# EAGLE design v1_r0 (EAGLE 9.6.2)
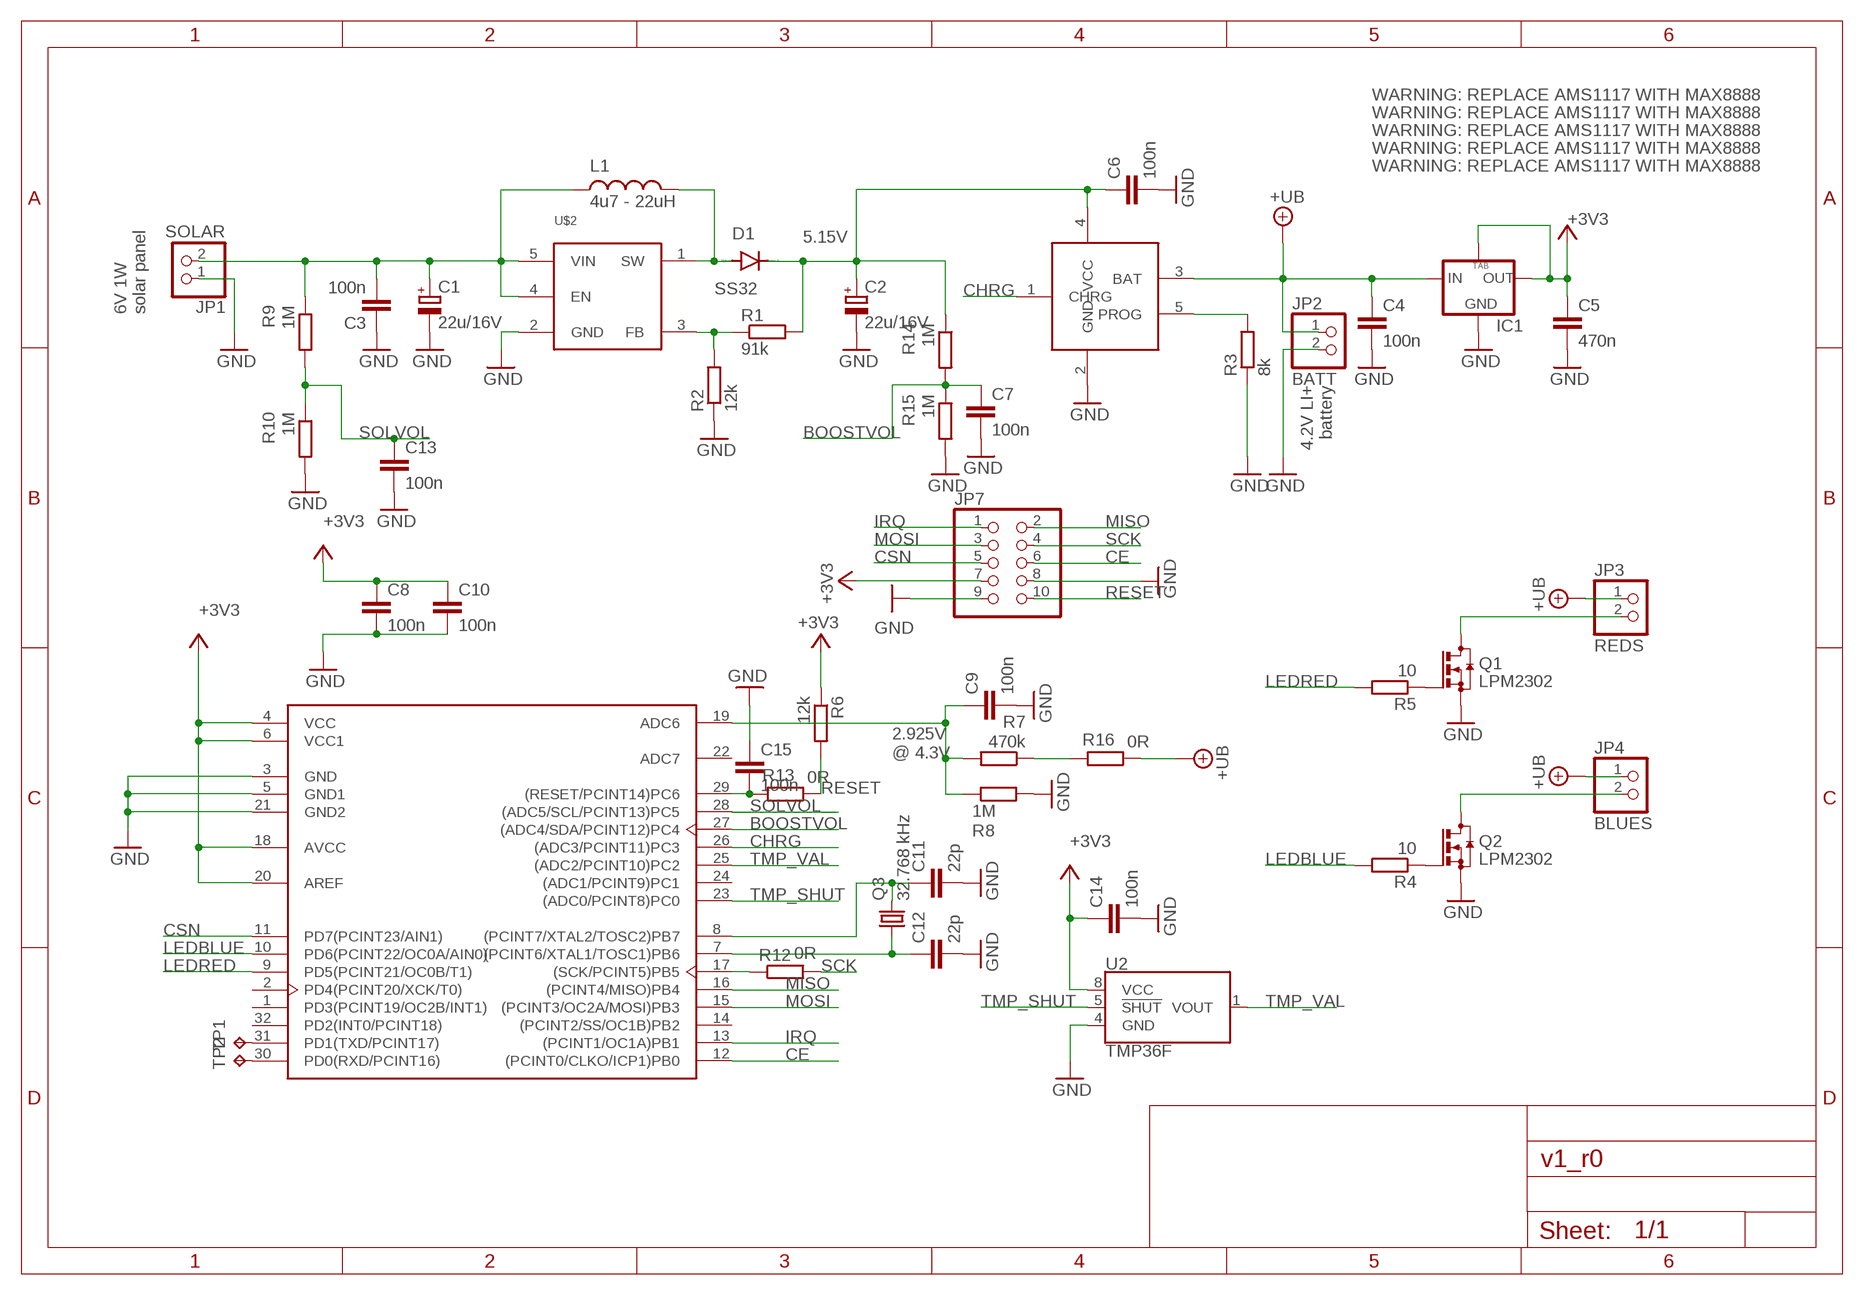
[diagram p0: schematic, sheet 1]

## Parts
C1  22u/16V  CPOL-EUCT6032  [CT6032]
C2  22u/16V  CPOL-EUCT6032  [CT6032]
C3  100n  C-EUC0603  [C0603]
C4  100n  C-EUC0603  [C0603]
C5  470n  C-EUC0603  [C0603]
C6  100n  C-EUC0603  [C0603]
C7  100n  C-EUC0603  [C0603]
C8  100n  C-EUC0603  [C0603]
C9  100n  C-EUC0603  [C0603]
C10  100n  C-EUC0603  [C0603]
C11  22p  C-EUC0603  [C0603]
C12  22p  C-EUC0603  [C0603]
C13  100n  C-EUC0603  [C0603]
C14  100n  C-EUC0603  [C0603]
C15  100n  C-EUC0603  [C0603]
D1  SS32  ES2D  [SMB]
IC1  LM1117  [SOT223]
JP1  SOLAR  PINHD-1X2  [1X02]
JP2  BATT  PINHD-1X2  [1X02]
JP3  REDS  PINHD-1X2  [1X02]
JP4  BLUES  PINHD-1X2  [1X02]
JP7  PINHD-2X5  [2X05]
L1  4u7 - 22uH  DS1608C  [DS1608]
Q1  LPM2302  BSS123  [SOT23]
Q2  LPM2302  BSS123  [SOT23]
Q3  32.768 kHz  CRYSTALCTS406  [CTS406]
R1  91k  R-EU_R0603  [R0603]
R2  12k  R-EU_R0603  [R0603]
R3  8k  R-EU_R0603  [R0603]
R4  10  R-EU_R0603  [R0603]
R5  10  R-EU_R0603  [R0603]
R6  12k  R-EU_R0603  [R0603]
R7  470k  R-EU_R0603  [R0603]
R8  1M  R-EU_R0603  [R0603]
R9  1M  R-EU_R0603  [R0603]
R10  1M  R-EU_R0603  [R0603]
R12  0R  R-EU_0204/5  [0204/5]
R13  0R  R-EU_0204/5  [0204/5]
R14  1M  R-EU_R0603  [R0603]
R15  1M  R-EU_R0603  [R0603]
R16  0R  R-EU_0204/5  [0204/5]
TP1  TPB1,27  [B1,27]
TP2  TPB1,27  [B1,27]
U1  ATMEGA*  ATMEGA328P-AU  [TQFP-32]
U2  TMP36F  TMP36  [SOIC-8]
U$1  LTC4054  [LTC4054]
U$2  SB6284  [SOT23-6]

## Nets
+3V3: C5.1 C8.1 C10.1 C14.1 IC1.2(OUT) IC1.4(TAB) JP7.7 R6.1 U1.4(VCC) U1.6(VCC1) U1.18(AVCC) U1.20(AREF) U2.8(VCC)
+UB: C4.1 IC1.3(IN) JP2.1 JP3.1 JP4.1 R16.1 U$1.3(BAT)
BOOSTVOL: C7.1 R14.2 R15.1 U1.27((ADC4/SDA/PCINT12)PC4)
BOOSTVOL1: C2.+ C6.1 D1.C R1.2 R14.1 U$1.4(VCC)
CE: JP7.6 U1.12((PCINT0/CLKO/ICP1)PB0)
CHRG: U1.26((ADC3/PCINT11)PC3) U$1.1(CHRG)
CSN: JP7.5 U1.11(PD7(PCINT23/AIN1))
GND: C1.- C2.- C3.1 C4.2 C5.2 C6.2 C7.2 C8.2 C9.2 C10.2 C11.2 C12.2 C13.2 C14.2 C15.1 IC1.1(GND) JP1.1 JP2.2 JP7.8 JP7.9 Q1.2(S) Q2.2(S) R2.1 R3.1 R8.2 R10.2 R15.2 U1.3(GND) U1.5(GND1) U1.21(GND2) U2.4(GND) U$1.2(GND) U$2.2(GND)
IRQ: JP7.1 U1.13((PCINT1/OC1A)PB1)
LEDBLUE: R4.2 U1.10(PD6(PCINT22/OC0A/AIN0))
LEDRED: R5.2 U1.9(PD5(PCINT21/OC0B/T1))
MISO: JP7.2 U1.16((PCINT4/MISO)PB4)
MOSI: JP7.3 U1.15((PCINT3/OC2A/MOSI)PB3)
N$1: R3.2 U$1.5(PROG)
N$2: D1.A L1.P$1 U$2.1(SW)
N$3: R1.1 R2.2 U$2.3(FB)
N$4: Q2.1(G) R4.1
N$5: Q1.1(G) R5.1
N$6: JP3.2 Q1.3(D)
N$7: JP4.2 Q2.3(D)
N$8: R12.1 U1.17((SCK/PCINT5)PB5)
N$9: C9.1 R7.2 R8.1 U1.19(ADC6)
N$10: R7.1 R16.2
N$11: TP1.TP U1.31(PD1(TXD/PCINT17))
N$12: C12.1 Q3.1 U1.7((PCINT6/XTAL1/TOSC1)PB6)
N$13: C11.1 Q3.3 U1.8((PCINT7/XTAL2/TOSC2)PB7)
N$14: TP2.TP U1.30(PD0(RXD/PCINT16))
N$333: C15.2 R13.2 U1.29((RESET/PCINT14)PC6)
RESET: JP7.10 R6.2 R13.1
SCK: JP7.4 R12.2
SOLIN: C1.+ C3.2 JP1.2 L1.P$2 R9.1 U$2.4(EN) U$2.5(VIN)
SOLVOL: C13.1 R9.2 R10.1 U1.28((ADC5/SCL/PCINT13)PC5)
TMP_SHUT: U1.23((ADC0/PCINT8)PC0) U2.5(!SHUT)
TMP_VAL: U1.25((ADC2/PCINT10)PC2) U2.1(VOUT)
Unconnected: U1.1(PD3(PCINT19/OC2B/INT1)) U1.2(PD4(PCINT20/XCK/T0)) U1.14((PCINT2/SS/OC1B)PB2) U1.22(ADC7) U1.24((ADC1/PCINT9)PC1) U1.32(PD2(INT0/PCINT18))

## Notes on the sheet
- WARNING: REPLACE AMS1117 WITH MAX8888
- WARNING: REPLACE AMS1117 WITH MAX8888
- WARNING: REPLACE AMS1117 WITH MAX8888
- WARNING: REPLACE AMS1117 WITH MAX8888
- WARNING: REPLACE AMS1117 WITH MAX8888
- 5.15V
- 6V 1W
  solar panel
- 4.2V LI+
  battery
- 2.925V
  @ 4.3V

## Library data of the parts
C1 C2 = rcl:CPOL-EU: POLARIZED CAPACITOR, European symbol; SPICEPREFIX: C
C3-C15 = rcl:C-EU: CAPACITOR, European symbol; SPICEPREFIX: C
D1 = diode:ES2D: DIODE super fast rectifier, 2 A
IC1 = v-reg-3:LM1117
JP1-JP4 = pinhead:PINHD-1X2: PIN HEADER
JP7 = pinhead:PINHD-2X5: PIN HEADER
L1 = inductor-coilcraft:DS1608: SMT Power Inductors
Q1 Q2 = transistor-small-signal:BSS123: N-CHANNEL MOS FET
Q3 = adafruit:CRYSTAL: CRYSTAL; OC_FARNELL: unknown; OC_NEWARK: unknown
R1-R10 R14 R15 = rcl:R-EU_: RESISTOR, European symbol; SPICEPREFIX: R
R12 R13 R16 = resistor:R-EU_: RESISTOR, European symbol
TP1 TP2 = testpad:TP: Test pad
U1 = Microcontroller:ATMEGA328P-AU: IC MCU 8BIT 32KB FLASH 32TQFP Manufacturer's datasheet <http://ww1.microchip.com/downloads/en/DeviceDoc/ATmega48A-PA-88A-PA-168A-PA-328-P-DS-DS40002061A.pdf>; CREATED_BY: PCBLayout.com; DIGIKEY_PART_NUMBER: ATMEGA328P-AU-ND; MANUFACTURER: Microchip Technology; MPN: ATMEGA328P-AU; PACKAGE: TQFP-32
U2 = SparkFun-Sensors:TMP36: TMP36 Precision Analog °C Temperature Sensor The TMP36 is a low voltage, precision centigrade temperature sensor. It provides a voltage output that is linearly proportional to the Celsius temperature. It also doesn’t require any external calibration to provide typical accuracies of ±1°C at +25°C and ±2°C over the −40°C to +125°C temperature range. We like it because it’s so easy to use: Just give the device a ground and 2.7 to 5.5 VDC and read the voltage on the Vout pin. The output voltage can be converted to temperature easily using the scale factor of 10 mV/°C. Datasheet <http://cdn.sparkfun.com/datasheets/Sensors/Temp/TMP35_36_37.pdf> SparkFun Products Temperature Sensor - TMP36 <https://www.sparkfun.com/products/10988> (SEN-10988) SparkFun Danger Shield <https://www.sparkfun.com/products/11649> (DEV-11649)
U$1 = LTC4054:LTC4054: LTC4054 Li-ion Charger IC TSOT 5
U$2 = trax_832:SB6284

## Board
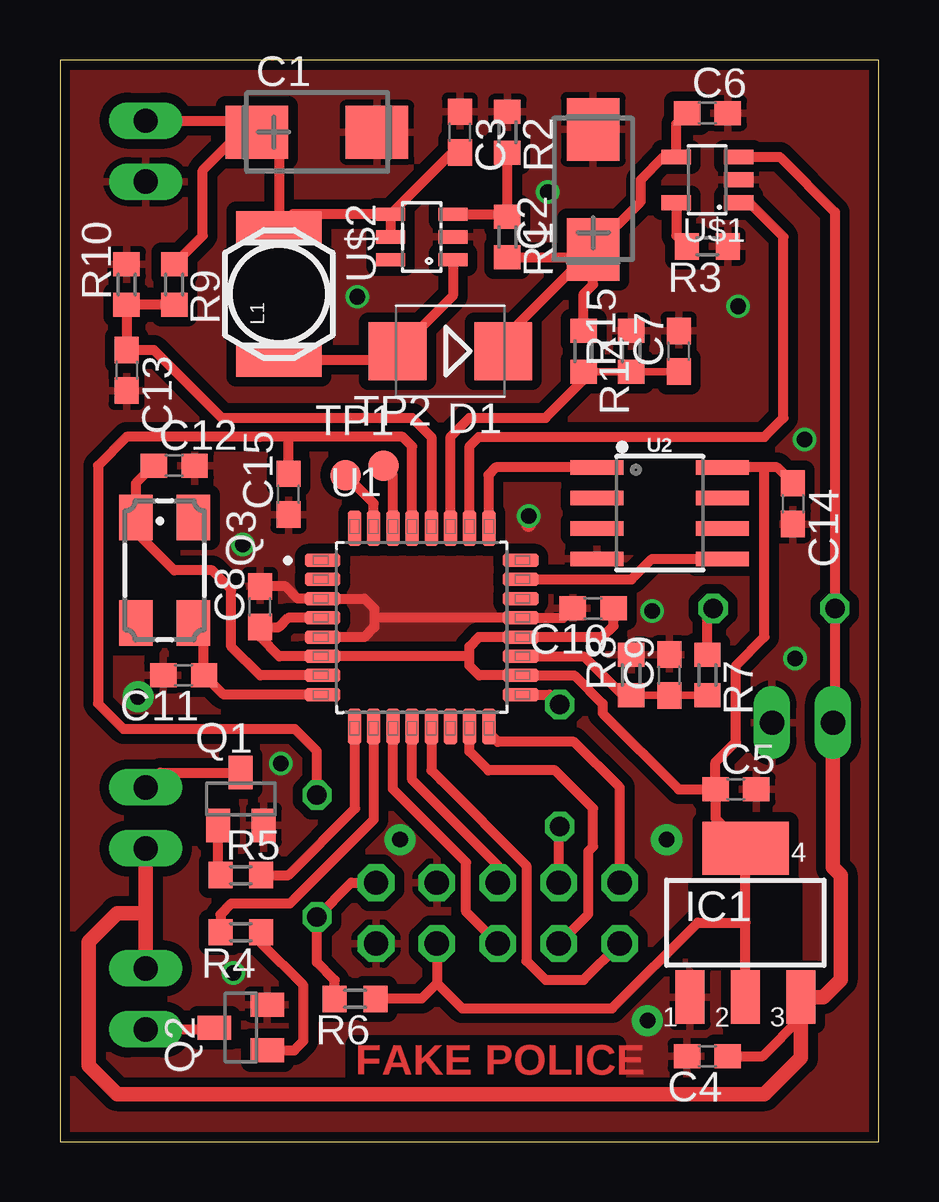
[diagram p1: board, top side]
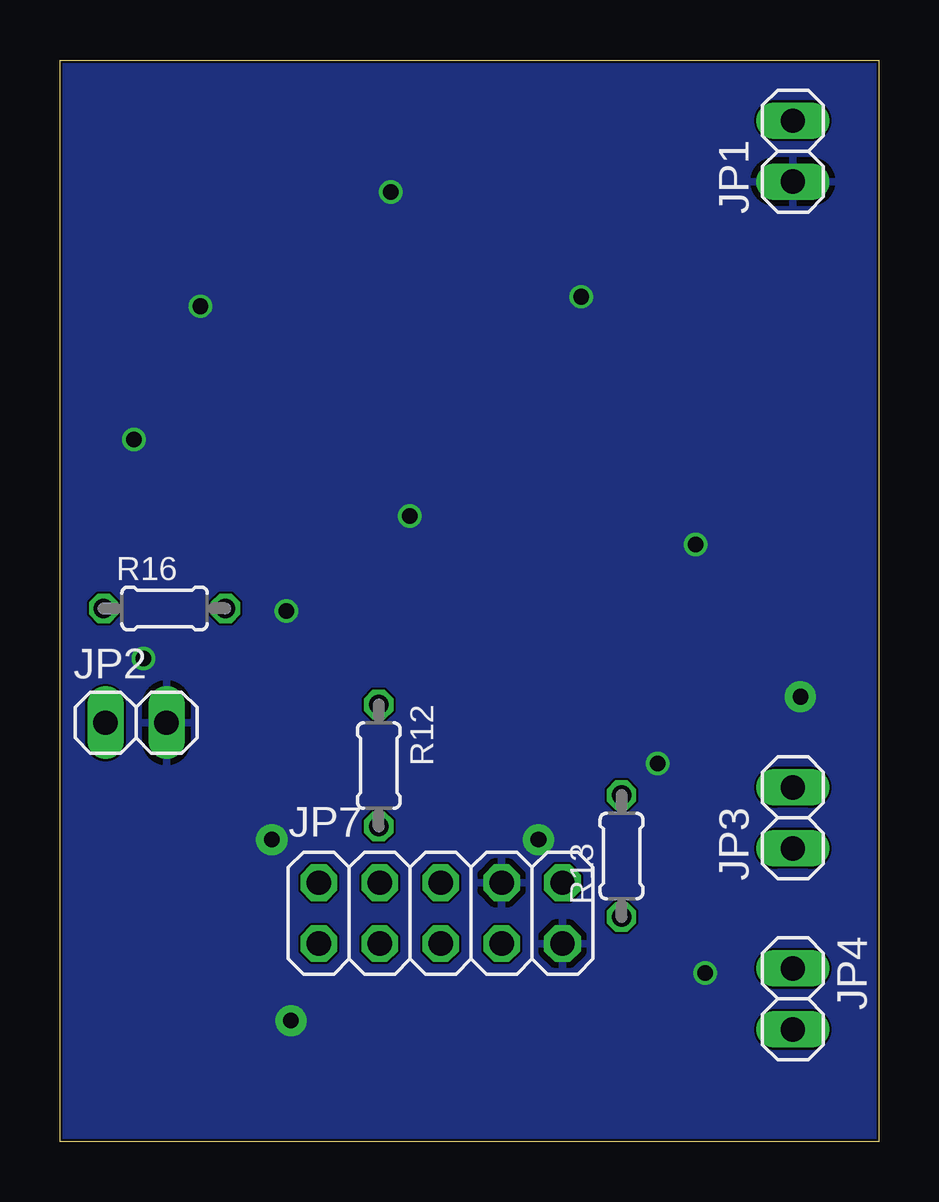
[diagram p2: board, bottom side, seen from below]

Size 34.12 x 45.08 mm. Coordinates in mm from the lower left corner, seen from the top.
Outline: 0,0 34.12,0 34.12,45.08 0,45.08 0,0
Copper layers (1*16): Top 0.035mm / dielectric 0.2mm / Bottom 0.035mm
Design rules "jlcpcb-2-layer": minimum track width 3.5mil, minimum drill 0.2mm, track to track 3.5mil, track to pad 5mil, pad to pad 5mil, via to via 5mil, smd to smd 0mil, copper to edge 0.1mm, drill to drill 5mil, minimum pad ring 4mil, minimum via ring 4mil, stop-mask expansion 3mil, vias tented up to drill 100mil, thermal gap 10mil
tRestrict: area 7.1,33.7 to 11.1,36.9; area 26.6,7.5 to 30.6,10.7

### Footprints (pad centres in the part's own frame; a part is rotated, then mirrored left to right if it is on the bottom)
CT6032 = smd 2.6 x 2.2: + -2.5,0; - 2.5,0
C0603 = smd 1.1 x 1: 1 -0.85,0; 2 0.85,0
SMB = smd 2.4 x 2.4: A 2.2,0; C -2.2,0
SOT223 = smd 1.219 x 2.235: 1 -2.311,-3.099; 2 0,-3.099; 3 2.311,-3.099 | smd 3.6 x 2.2: 4 0,3.099
1X02 = drill 1.016 long: 1 -1.27,0; 2 1.27,0
2X05 = drill 1.016 octagon: 1 -5.08,-1.27; 2 -5.08,1.27; 3 -2.54,-1.27; 4 -2.54,1.27; 5 0,-1.27; 6 0,1.27; 7 2.54,-1.27; 8 2.54,1.27; 9 5.08,-1.27; 10 5.08,1.27
DS1608 = smd 1.397 x 3.556: P$1 -2.743,0; P$2 2.743,0
SOT23 = smd 1 x 1.4: 1 -0.95,-1.1; 2 0.95,-1.1; 3 0,1.1
CTS406 = smd 1.9 x 1.4: 1 -2.2,-1.2; 2 2.2,-1.2; 3 2.2,1.2; 4 -2.2,1.2
R0603 = smd 1 x 1.1: 1 -0.85,0; 2 0.85,0
0204/5 = drill 0.813 octagon: 1 -2.54,0; 2 2.54,0
B1,27 = smd 1.27 x 1.27: TP 0,0
TQFP-32 = smd 1.5 x 0.57: 1 -4.13,2.8; 2 -4.13,2; 3 -4.13,1.2; 4 -4.13,0.4; 5 -4.13,-0.4; 6 -4.13,-1.2; 7 -4.13,-2; 8 -4.13,-2.8; 17 4.13,-2.8; 18 4.13,-2; 19 4.13,-1.2; 20 4.13,-0.4; 21 4.13,0.4; 22 4.13,1.2; 23 4.13,2; 24 4.13,2.8 | smd 0.57 x 1.5: 9 -2.8,-4.13; 10 -2,-4.13; 11 -1.2,-4.13; 12 -0.4,-4.13; 13 0.4,-4.13; 14 1.2,-4.13; 15 2,-4.13; 16 2.8,-4.13; 25 2.8,4.13; 26 2,4.13; 27 1.2,4.13; 28 0.4,4.13; 29 -0.4,4.13; 30 -1.2,4.13; 31 -2,4.13; 32 -2.8,4.13
SOIC-8 = smd 0.61 x 2.21: 1 -1.905,-2.616; 2 -0.635,-2.616; 3 0.635,-2.616; 4 1.905,-2.616; 5 1.905,2.616; 6 0.635,2.616; 7 -0.635,2.616; 8 -1.905,2.616
LTC4054 = smd 0.62 x 1.22: 1 -0.95,-1.3; 2 0,-1.3; 3 0.95,-1.3; 4 0.95,1.3; 5 -0.95,1.3
SOT23-6 = smd 0.55 x 1.2: 1 -0.95,-1.3; 2 0,-1.3; 3 0.95,-1.3; 4 0.95,1.3; 5 -0.003,1.3; 6 -0.95,1.3

### Placement (x,y rotation side)
C1  10.72,42.07 0 top
C2  22.23,39.69 90 top
C3  16.67,42.07 270 top
C4  26.99,3.57 180 top
C5  28.18,14.68 0 top
C6  26.99,42.86 0 top
C7  25.8,32.94 90 top
C8  8.33,22.29 90 top
C9  25.4,19.45 90 top
C10  22.23,22.23 180 top
C11  5.16,19.45 180 top
C12  4.76,28.18 0 top
C13  2.78,32.15 270 top
C14  30.56,26.59 270 top
C15  9.53,26.99 90 top
D1  16.27,32.94 180 top
IC1  28.57,9.13 0 top
JP1  3.57,41.27 90 bottom
JP2  30.96,17.46 0 bottom
JP3  3.57,13.49 90 bottom
JP4  3.57,5.95 270 bottom
JP7  18.26,9.53 0 bottom
L1  9.13,35.32 90 top
Q1  7.54,14.29 0 top
Q2  7.54,4.76 90 top
Q3  4.37,23.81 270 top
R1  18.65,37.7 270 top
R2  18.65,42.07 270 top
R3  26.99,37.31 180 top
R4  7.54,8.73 180 top
R5  7.54,11.11 0 top
R6  12.3,5.95 180 top
R7  26.99,19.45 270 top
R8  23.81,19.45 90 top
R9  4.76,35.72 270 top
R10  2.78,35.72 90 top
R12  20.84,15.68 270 bottom
R13  10.72,11.91 90 bottom
R14  21.83,32.94 270 top
R15  23.81,32.94 90 top
R16  29.77,22.23 0 bottom
TP1  11.91,27.78 0 top
TP2  13.49,28.18 0 top
U1  15.08,21.43 0 top
U2  25,26.19 270 top
U$1  26.99,40.08 90 top
U$2  15.08,37.7 90 top

### Tracks (layer width: path | path; a pad name or v marks a point on that pad's centre or on a via)
+3V3
  Top 0.406: U1.6 10.96,20.24 | 17.07,20.24 17.07,19.84 17.48,19.43 U1.18 21.45,19.43 22.62,18.26 22.62,17.86 25.8,14.68 C5.1 | 17.07,20.24 17.07,20.64 17.46,21.03 U1.20 22.62,21.03 23.07,21.49 C10.1 23.07,21.77 | U1.4 9.52,21.83 9.13,21.44 C8.1 8.33,21.03 9.14,20.23 U1.6 | JP7.7 15.72,6.6 | R6.1 13.17,5.97 15.08,5.97 15.72,6.6 | IC1.2 28.57,9.13 | 28.57,9.13 IC1.4 27.33,13.47 C5.1 | 15.72,6.6 16.76,5.56 23.02,5.56 26.59,9.13 28.57,9.13 | C14.1 29.9,28.1 29.37,28.1 | 29.37,28.1 U2.8 | 29.37,28.1 29.37,21.03 28.18,19.84 28.18,16.67 27.33,15.82 C5.1 | 10.96,20.24 U1.6 | 17.07,20.24 10.96,20.24
+UB
  Top 0.406: U$1.3 30.01,41.03 32.31,38.73 R16.1 32.31,17.54 JP2.1 | C4.1 29.3,3.57 30.89,5.16
  Top 0.61: JP3.1 3.57,9.53 | 3.57,9.53 JP4.1 | 3.57,9.53 2.38,9.53 1.19,8.33 1.19,3.17 2.38,1.98 29.37,1.98 30.89,3.5 30.89,5.16 IC1.3 31.83,6.03 32.54,6.75 32.54,11.11 32.23,11.43 JP2.1
BOOSTVOL
  Top 0.305: R14.2 R15.1 C7.1
  Top 0.406: U1.27 16.28,29.38 17.07,30.16 20.24,30.16 21.83,31.75 R14.2
BOOSTVOL1
  Top 0.305: D1.C 18.56,33.03 18.65,33.12
  Top 0.406: 18.65,33.12 18.56,33.03 | D1.C 18.47,33.43 C2.+ | R14.1 21.83,35.32 22.23,35.72 C2.+ | C2.+ 24.21,39.17 24.21,40.08 25.16,41.03 U$1.4 25.69,42.41 C6.1 | R1.2 21.89,36.85 C2.+
CE
  Top 0.406: JP7.6 18.26,11.51 15.48,14.29 14.68,15.08 U1.12
CHRG
  Top 0.406: U$1.1 28.73,39.13 30.16,37.7 30.16,30.16 29.37,29.37 17.46,29.37 17.08,28.99 U1.26
CSN
  Top 0.406: JP7.5 16.93,9.58 16.93,11.64 13.88,14.69 U1.11
GND  (via drill 0.65, 0.65 pad 1.3)
  Top 0.406: 13.1,21.83 13.1,22.23 12.69,22.63 U1.3 9.91,22.63 9.4,23.14 C8.2 | 13.1,21.83 13.1,21.43 12.7,21.03 U1.5 | C10.2 20.98,21.83 U1.21 13.1,21.83
  Top 0.61: 19.53,25.71 v19.53,26.08
  other vias: 25.29,12.59 14.18,12.59 3.26,18.55 7.63,24.89 24.69,22.11 28.27,34.81 20.33,39.58 12.39,35.21 9.22,15.76 7.23,7.03 24.5,5.05 31.04,29.26 30.65,20.13
  pour Bottom: 0,45.24 0,0 34.13,0 34.13,45.24
  pour Top (isolate 0.406): 0,45.24 34.13,45.24 34.13,0 0,0
IRQ
  Top 0.406: U1.13 15.48,15.47 15.88,15.08 19.45,11.51 19.45,7.54 20.24,6.75 21.83,6.75 JP7.1
LEDBLUE
  Top 0.305: U1.10 13.08,16.65
  Top 0.406: U1.10 13.08,13.42 9.58,9.92 7.14,9.92 6.69,9.47 R4.2
LEDRED
  Top 0.406: U1.9 12.3,17.28 12.3,13.89 9.53,11.11 R5.2
MISO
  Top 0.406: U1.16 17.88,17.04 18.26,16.67 21.43,16.67 23.34,14.76 JP7.2
MOSI
  Top 0.406: JP7.3 22.03,9.48 22.03,12.11 22.23,12.3 22.23,13.89 20.64,15.48 17.86,15.48 17.07,16.27 17.07,17.29 U1.15
N$1
  Top 0.406: U$1.5 25.69,37.76 R3.2
N$2
  Top 0.305: 14.07,33.16 D1.A
  Top 0.406: L1.P$1 13.71,32.58 D1.A 16.38,35.25 U$2.1
N$3
  Top 0.406: U$2.3 18.55,38.65 R1.1 R2.2
N$4
  Top 0.406: Q2.1 9.77,3.81 10.15,4.2 10.15,6.51 8.39,8.28 R4.1
N$5
  Top 0.406: R5.1 6.59,11.21 Q1.1
N$6
  Top 0.406: JP3.2 4.2,15.39 Q1.3
N$7
  Top 0.406: JP4.2 6.36,4.68 Q2.3
N$8
  Top 0.406: U1.17 20.42,18.63 R12.1
N$9
  Top 0.305: U1.19 | R7.2 C9.1 23.87,18.6 23.81,18.65
  Top 0.406: U1.19 21.84,20.23 23.47,18.6 R8.1 23.81,18.65
N$10
  Top 0.406: R7.1 26.99,21.99 R16.2
N$11
  Top 0.406: U1.31 13.08,26.61 TP1.TP
N$12
  Top 0.305: Q3.1 3.12,26.06
  Top 0.406: C12.1 3.17,27.43 Q3.1 3.17,25.41 4.76,23.81 6.35,23.81 7.14,23.02 7.14,20.64 8.35,19.43 U1.7
N$13
  Top 0.406: Q3.3 5.96,21.22 5.96,19.49 C11.1 6.83,18.63 U1.8
N$14
  Top 0.406: U1.30 13.88,27.79 TP2.TP
N$333
  Top 0.406: U1.29 14.68,28.98 14.29,29.37 9.53,29.37 | 9.53,29.37 8.33,29.37 2.78,29.37 1.59,28.18 1.59,18.26 2.65,17.19 9.79,17.19 10.72,16.27 R13.2 | C15.2 9.53,29.37
RESET
  Top 0.406: JP7.10 12.14,10.79 R13.1 10.72,7.47 11.45,6.74 R6.2
SCK
  Top 0.406: JP7.4 20.8,13.1 R12.2
SOLIN
  Top 0.305: 8.16,42.12 C1.+
  Top 0.406: JP1.2 7.74,42.55 8.16,42.12 | 8.16,42.12 C1.+ 9.13,41.16 L1.P$2 9.72,38.65 U$2.4 | R9.1 5.95,37.76 5.95,40.48 7.6,42.12 8.16,42.12 | U$2.4 U$2.5 | U$2.4 16.35,41.22 C3.2
SOLVOL
  Top 0.305: 15.49,25.57 U1.28
  Top 0.406: R9.2 R10.1 C13.1 3.91,33 6.75,30.16 14.68,30.16 15.48,29.37 U1.28
TMP_SHUT
  Top 0.406: U1.23 23.83,23.43 24.69,24.29 U2.5
TMP_VAL
  Top 0.406: U2.1 18.18,28.1 17.86,27.78 17.86,25.58 U1.25

### Text on the board
Top: FAKE POLICE